# Altium project volt_sense.PrjPCB
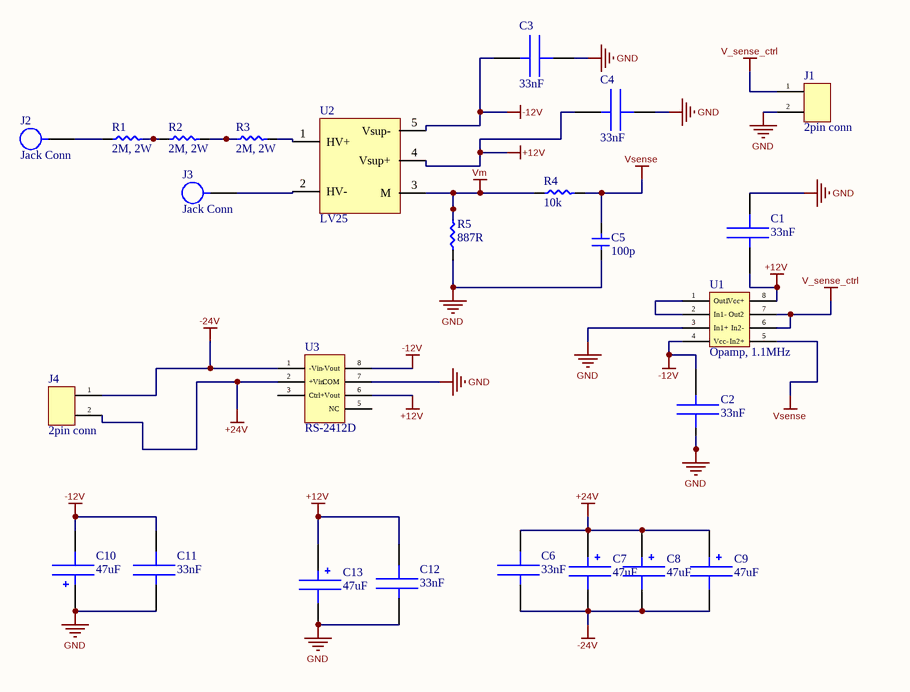
[diagram p0: volt_sense.SchDoc]
1 sheet, 25 parts. Net scope: global (net labels, ports and power ports of the same name join across sheets).
Board file: volt_sense.PcbDoc

## Sheet volt_sense.SchDoc
size A3

### Parts
C1  33nF  [C1206]
C2  33nF  [C1206]
C3  33nF  [C1206]
C4  33nF  [C1206]
C5  100p  [C0603]
C6  33nF  [C1206]
C7  47uF  [CAPAE7266X82N]
C8  47uF  [CAPAE7266X82N]
C9  47uF  [CAPAE7266X82N]
C10  47uF  [CAPAE7266X82N]
C11  33nF  [C1206]
C12  33nF  [C1206]
C13  47uF  [CAPAE7266X82N]
J1  2pin conn  [2pin_0.1in]
J2  Jack Conn  [575-4]
J3  Jack Conn  [575-4]
J4  2pin conn  [2pin_0.1in]
R1  2M, 2W  [R2512]
R2  2M, 2W  [R2512]
R3  2M, 2W  [R2512]
R4  10k  [R0603]
R5  887R  [R0603]
U1  Opamp, 1.1MHz  [SO8]
U2  LV25  [LV25-P]
U3  RS-2412D  [RS2412D]

### Nets
+12V: C1.1 C4.1 C12.2 C13.1 U1.8(Vcc+) U2.4(Vsup+) U3.6(+Vout)
+24V: C6.2 C7.1 C8.1 C9.1 J4.2 U3.2(+Vin)
-12V: C2.1 C3.1 C10.2 C11.2 U1.4(Vcc-) U2.5(Vsup-) U3.8(-Vout)
-24V: C6.1 C7.2 C8.2 C9.2 J4.1 U3.1(-Vin)
GND: C1.2 C2.2 C3.2 C4.2 C5.1 C10.1 C11.1 C12.1 C13.2 J1.2 R5.1 U1.3(In1+) U3.7(COM)
V_sense_ctrl: J1.1 U1.6(In2-) U1.7(Out2)
Vm: R4.1 R5.2 U2.3(M)
Vsense: C5.2 R4.2 U1.5(In2+)
NetJ2_1: J2.1 R1.1
NetJ3_1: J3.1 U2.2(HV-)
NetR1_2: R1.2 R2.1
NetR2_2: R2.2 R3.1
NetR3_2: R3.2 U2.1(HV+)
NetU1_1: U1.1(Out1) U1.2(In1-)

Not connected (* = marked no-connect by the designer): U3 3(Ctrl) 5(NC)

### Library data of the parts
C1-C4 C6 C11 C12 = CL31B333JBCNNNC: Cap Ceramic 0.033uF 50V X7R 5% SMD 1206 125C Paper T/R; Manufacturer: Samsung; Supplier 1: Digi-Key; Manufacturer Part Number: CL31B333JBCNNNC; Stock 1: 21; Pricing 1: 1=0.18, 10=0.131, 100=0.0614, 500=0.04308, 1000=0.03567 (USD); Mount: Surface Mount; Case/Package: 1206; Case Code (Metric): 3216; Case Code (Imperial): 1206; Min Operating Temperature: -55°C; Max Operating Temperature: 125°C; Tolerance: 5%; Packaging: Tape and Reel; Capacitance: 33nF; Voltage Rating: 50V; Package Quantity: 1; Dielectric: X7R; Voltage: 50V; Voltage Rating (DC): 50V; Length: 3.2mm; Height: 0.85mm; Width: 0.063inch; Thickness: 0.039inch; Depth: 1.6mm; Radiation Hardening: No; Lead Free: Lead Free; Supplier Part Number 1: 1276-1774-6-ND
C5 = 06035C101KAT2A: Cap Ceramic 100pF 50V X7R 10% SMD 0603 125C T/R; Manufacturer: Kyocera AVX; Dissipation Factor: 2.5%; Temperature Coefficient: 0ppm/°C; Supplier 1: Mouser; Manufacturer Part Number: 06035C101KAT2A; Stock 1: 28330; Pricing 1: 1=0.27, 10=0.181, 50=0.181, 100=0.091, 1000=0.055, 10000=0.038 (USD); Mount: Surface Mount; Case/Package: 0603; Number of Pins: 2; Case Code (Metric): 1608; Case Code (Imperial): 0603; Contact Plating: Tin,Matte; Dielectric Material: Ceramic; Min Operating Temperature: -55°C; Max Operating Temperature: 125°C; Package Quantity: 1; Capacitance: 100pF; Tolerance: 10%; Packaging: Tape and Reel; Voltage Rating: 50V; Voltage Rating (DC): 50V; Dielectric: X7R; Termination: SMD/SMT; Length: 1.6mm; Width: 0.032inch; Thickness: 0.035inch; Depth: 0.81mm; Radiation Hardening: No; REACH SVHC: No SVHC; Lead Free: Lead Free; ComponentLink1URL: http://www.mouser.com/ds/2/40/X7RDielectric-777024.pdf?src-supplier=Mouser; ComponentLink1Description: http://www.mouser.com/ds/2/40/X7RDielectric-777024.pdf?src-supplier=Mouser; ComponentLink2URL: http://www.farnell.com/datasheets/1679506.pdf?src-supplier=Element14; ComponentLink2Description: http://www.farnell.com/datasheets/1679506.pdf?src-supplier=Element14; ComponentLink3URL: http://www.jameco.com/Jameco/Products/ProdDS/2012486.pdf?src-supplier=Jameco; ComponentLink3Description: http://www.jameco.com/Jameco/Products/ProdDS/2012486.pdf?src-supplier=Jameco; ComponentLink4URL: http://www.avx.com/docs/Catalogs/cx7r.pdf?src-supplier=Future+Electronics; ComponentLink4Description: http://www.avx.com/docs/Catalogs/cx7r.pdf?src-supplier=Future+Electronics; ComponentLink5URL: http://catalogs.avx.com/SurfaceMount.pdf?src-supplier=Digi-Key; ComponentLink5Description: http://catalogs.avx.com/SurfaceMount.pdf?src-supplier=Digi-Key; Supplier Part Number 1: 581-06035C101K
C7-C10 C13 = UCD1H470MCL1GS: Aluminum Electrolytic Capacitors - SMD 47uF 50V 105c; Manufacturer: Nichicon; Tolerance: 20%; Impedance: 630mR; Life (Hours): 2000Hour; Ripple Current: 195mA; Leakage Current: 493.5uA; Dissipation Factor: 0.1%; Supplier 1: Digi-Key; Manufacturer Part Number: UCD1H470MCL1GS; Stock 1: 232; Pricing 1: 1=0.55, 10=0.39, 100=0.2566 (USD); Mount: Surface Mount; Case/Package: Radial; Min Operating Temperature: -55°C; Max Operating Temperature: 105°C; Capacitance: 47uF; Voltage Rating: 50V; Packaging: Tape and Reel; Package Quantity: 1; Voltage Rating (DC): 50V; Termination: SMD/SMT; Voltage: 50V; Diameter: 6.3mm; Length: 7.7mm; Height: 7.7mm; Height - Seated (Max): 0.315inch; Radiation Hardening: No; Lead Free: Lead Free; ComponentLink1URL: http://www.nichicon.co.jp/english/products/pdfs/e-cd.pdf; ComponentLink1Description: http://www.nichicon.co.jp/english/products/pdfs/e-cd.pdf; ComponentLink2URL: http://nichicon-us.com/english/products/pdfs/e-ucd.pdf; ComponentLink2Description: http://nichicon-us.com/english/products/pdfs/e-ucd.pdf; ComponentLink3URL: http://uk.rs-online.com/webdocs/0ebd/0900766b80ebdadd.pdf; ComponentLink3Description: http://uk.rs-online.com/webdocs/0ebd/0900766b80ebdadd.pdf; ComponentLink4URL: http://products.nichicon.co.jp/en/pdf/XJA043/e-cd.pdf; ComponentLink4Description: http://products.nichicon.co.jp/en/pdf/XJA043/e-cd.pdf; Supplier Part Number 1: 493-6183-6-ND
J1 J4 = 640456-2: CONN HEADER VERT 2POS 2.54MM; Manufacturer: TE Connectivity; Connector Type: Connector,Pin,Plug,Header; Contact Resistance: 6mR; Max Voltage Rating (AC): 250V; Number of Positions: 2; Backwall/Post Interruptions: No (Without); Connector System: Wire-to-Board; Plating Thickness: 3.81um; PCB Mount Retention: Without; Contact Current Rating: 5A; Gender: Male; PCB Mounting Orientation: Vertical; Circuit Application: Signal; Contact Style: Straight; Mating Connector Lock: Yes (With); Contact Post Length: 3.56mm; PCB Thickness: 0.063inch; Tail Length: 0.14inch; Approvals: CSA; Supplier 1: Digi-Key; Manufacturer Part Number: 640456-2; Stock 1: 105696; Pricing 1: 1=0.11, 10=0.107, 100=0.0663, 500=0.05486, 1000=0.048, 5000=0.04114, 10000=0.04 (USD); Mount: Through Hole; Color: Natural,White,Beige; Contact Plating: Tin; Contact Material: Copper Alloy; Housing Color: Natural; Housing Material: Polyester; Contact Shape: Square; Min Operating Temperature: -67°C; Max Operating Temperature: 221°C; Package Quantity: 5000; Packaging: Bulk; Termination: Solder; Number of Rows: 1; Fastening Type: Friction; Contact Gender: Male; Voltage Rating (AC): 250V; Number of Contacts: 2; Orientation: Straight; Contact Retention: No (Without); Mating Alignment: No (Without); Mating Retention: No (Without); PCB Mount Alignment: No (Without); Sealable: No (Without); Strain Relief: No (Without); Shrouded: No (Without); Current Rating: 5A; Number of Poles: 2; Voltage Rating: 250V; Working Voltage: 250V; Panel Mount Retention: No (Without); Mounting Ears: No (Without); Length: 7.62mm; Height: 7.87mm; Pitch: 2.54mm; Depth: 5.72mm; Lead Pitch: 2.54mm; Contact Mating Length: 7.49mm; Radiation Hardening: No; ELV: Compliant; Lead Free: Lead Free; Flammability Rating: UL94 V-0; REACH SVHC: No SVHC; ComponentLink1URL: https://www.te.com/commerce/DocumentDelivery/DDEController?Action=srchrtrv&DocNm=640456&DocType=Customer+Drawing&DocLang=English&src-supplier=Digi-Key; ComponentLink1Description: https://www.te.com/commerce/DocumentDelivery/DDEController?Action=srchrtrv&DocNm=640456&DocType=Customer+Drawing&DocLang=English&src-supplier=Digi-Key; ComponentLink2URL: http://www.te.com/commerce/DocumentDelivery/DDEController?Action=showdoc&DocId=Data+Sheet%7F82056_MTA%7F0608%7Fpdf%7FEnglish%7FENG_DS_82056_MTA_0608.pdf%7F640456-6&src-supplier=Avnet; ComponentLink2Description: http://www.te.com/commerce/DocumentDelivery/DDEController?Action=showdoc&DocId=Data+Sheet%7F82056_MTA%7F0608%7Fpdf%7FEnglish%7FENG_DS_82056_MTA_0608.pdf%7F640456-6&src-supplier=Avnet; ComponentLink3URL: https://www.distrelec.biz/Web/Downloads/43/01/04384301.pdf?mime=application%2Fpdf&src-supplier=Distrelec; ComponentLink3Description: https://www.distrelec.biz/Web/Downloads/43/01/04384301.pdf?mime=application%2Fpdf&src-supplier=Distrelec; ComponentLink4URL: http://www.farnell.com/datasheets/2043229.pdf?src-supplier=Newark; ComponentLink4Description: http://www.farnell.com/datasheets/2043229.pdf?src-supplier=Newark; ComponentLink5URL: http://www.te.com/commerce/DocumentDelivery/DDEController?Action=showdoc&DocId=Data+Sheet%7F82056_MTA%7F0608%7Fpdf%7FEnglish%7FENG_DS_82056_MTA_0608.pdf%7F640456-2&src-supplier=Future+Electronics; ComponentLink5Description: http://www.te.com/commerce/DocumentDelivery/DDEController?Action=showdoc&DocId=Data+Sheet%7F82056_MTA%7F0608%7Fpdf%7FEnglish%7FENG_DS_82056_MTA_0608.pdf%7F640456-2&src-supplier=Future+Electronics; ComponentLink6URL: http://www.te.com/commerce/DocumentDelivery/DDEController?Action=showdoc&DocId=Data+Sheet%7F82056_MTA%7F0608%7Fpdf%7FEnglish%7FENG_DS_82056_MTA_0608.pdf%7F640456-6&src-supplier=Avnet+Asia; ComponentLink6Description: http://www.te.com/commerce/DocumentDelivery/DDEController?Action=showdoc&DocId=Data+Sheet%7F82056_MTA%7F0608%7Fpdf%7FEnglish%7FENG_DS_82056_MTA_0608.pdf%7F640456-6&src-supplier=Avnet+Asia; Supplier Part Number 1: A1921-ND
J2 J3 = 575-4: JACK NON-INSULATED .218"; Manufacturer: Keystone Electronics; Gender: Female; Number of Positions: 1; Supplier 1: Digi-Key; Manufacturer Part Number: 575-4; Stock 1: 21251; Pricing 1: 1=0.84, 10=0.692, 50=0.6244, 250=0.543, 1000=0.4558, 2500=0.4073, 5000=0.3801 (USD); Mount: Panel,Through Hole; Number of Pins: 1; Contact Plating: Nickel; Color: White; Contact Material: Brass; Material: Brass,Tin; Packaging: Bulk; Package Quantity: 100; Termination: Solder; Insulation: Non-Insulated; Lead Free: Lead Free; ComponentLink1URL: http://www.mouser.com/ds/2/215/75-4_575-8-743912.pdf?src-supplier=Mouser; ComponentLink1Description: http://www.mouser.com/ds/2/215/75-4_575-8-743912.pdf?src-supplier=Mouser; ComponentLink2URL: http://www.keyelco.com/pdfs/M60/M60p107.pdf?src-supplier=Digi-Key; ComponentLink2Description: http://www.keyelco.com/pdfs/M60/M60p107.pdf?src-supplier=Digi-Key; Supplier Part Number 1: 36-575-4-ND
R1-R3 = SMV2W1M2JT: Manufacturer: TE Connectivity; Supplier 1: Mouser; Manufacturer Part Number: SMV2W1M2JT; Stock 1: 1000; Pricing 1: 1=0.71, 10=0.481, 50=0.481, 100=0.354, 1000=0.204, 10000=0.193 (USD); Supplier Part Number 1: 279-SMV2W1M2JT
R4 = RNCP0603FTD10K0: RES 10K OHM 1% 1/8W 0603; Manufacturer: Stackpole Electronics; Resistance: 10kR; Max Power Dissipation: 125mW; Temperature Coefficient: 100ppm/°C; Supplier 1: Digi-Key; Manufacturer Part Number: RNCP0603FTD10K0; Stock 1: 166858; Pricing 1: 1=0.1, 10=0.067, 100=0.0273, 1000=0.01224, 2500=0.01063 (USD); Mount: Surface Mount; Case/Package: 0603; Case Code (Metric): 1608; Case Code (Imperial): 0603; Contact Plating: Tin,Matte; Min Operating Temperature: -55°C; Max Operating Temperature: 155°C; Packaging: Tape and Reel; Tolerance: 1%; Composition: Thin Film; Number of Terminations: 2; Features: Moisture Resistant,Anti-Sulfur; Length: 0.059inch; Height: 0.02inch; Width: 0.031inch; Radiation Hardening: No; Lead Free: Lead Free; Supplier Part Number 1: RNCP0603FTD10K0CT-ND
R5 = ERA-3AEB8870V: RES SMD 887 OHM 0.1% 1/10W 0603; Manufacturer: Panasonic; Max Power Dissipation: 100mW; Temperature Coefficient: 25ppm/°C; Supplier 1: Digi-Key; Manufacturer Part Number: ERA-3AEB8870V; Stock 1: 18104; Pricing 1: 1=0.35, 10=0.3, 100=0.1172, 1000=0.04906, 2500=0.04498 (USD); Case/Package: 0603; Case Code (Imperial): 0603; Case Code (Metric): 1608; Min Operating Temperature: -55°C; Max Operating Temperature: 155°C; Composition: Thin Film; Features: Automotive AEC-Q200; Packaging: Tape and Reel; Resistance: 887R; Tolerance: 0.1%; Number of Terminations: 2; Length: 0.063inch; Width: 0.032inch; Height - Seated (Max): 0.022inch; Supplier Part Number 1: P887DBDKR-ND
U1 = LM358DT: IC OPAMP GP 1.1MHZ 8SO; Manufacturer: STMicroelectronics; Slew Rate: 0.6V/µs; Number of Channels: 2; Nominal Supply Current: 1.2mA; Common Mode Rejection Ratio: 70dB; Max Supply Voltage: 30V; Min Supply Voltage: 3V; Min Dual Supply Voltage: 1.5V; Max Dual Supply Voltage: 15V; Max Output Current: 60mA; Voltage Gain: 100dB; Dual Supply Voltage: 9V; Output Current: 40mA; Max Input Voltage: 28.5V; Min Input Voltage: 0uV; Input Bias Current: 150nA; Input Offset Voltage (Vos): 7mV; Operating Supply Current: 700uA; Supplier 1: Digi-Key; Manufacturer Part Number: LM358DT; Stock 1: 82250; Pricing 1: 1=0.48, 10=0.359, 100=0.2239, 500=0.1532, 1000=0.11784 (USD); Mount: Surface Mount; Case/Package: SOIC; Number of Pins: 8; Weight: 0.01lb; Contact Plating: Tin,Matte; Min Operating Temperature: 0°C; Max Operating Temperature: 70°C; Packaging: Tape and Reel; Bandwidth: 1.1MHz; Number of Circuits: 2; Gain Bandwidth Product: 1.1MHz; Unity Gain Bandwidth Product: 1.1MHz; Package Quantity: 2500; Operating Supply Voltage: 15V; Output Current per Channel: 60mA; Number of Elements: 2; Number of Amplifiers: 2; Length: 4.9mm; Height: 1.25mm; Width: 3.9mm; Radiation Hardening: No; REACH SVHC: No SVHC; Lead Free: Lead Free; ComponentLink1URL: http://www.st.com/content/ccc/resource/technical/document/datasheet/61/46/87/01/98/ed/44/c5/CD00000464.pdf/files/CD00000464.pdf/jcr:content/translations/en.CD00000464.pdf?src-supplier=Digi-Key; ComponentLink1Description: http://www.st.com/content/ccc/resource/technical/document/datasheet/61/46/87/01/98/ed/44/c5/CD00000464.pdf/files/CD00000464.pdf/jcr:content/translations/en.CD00000464.pdf?src-supplier=Digi-Key; ComponentLink2URL: http://www.st.com/web/en/resource/technical/document/datasheet/CD00000464.pdf?src-supplier=Future+Electronics; ComponentLink2Description: http://www.st.com/web/en/resource/technical/document/datasheet/CD00000464.pdf?src-supplier=Future+Electronics; ComponentLink3URL: http://www.alliedelec.com/images/products/datasheets/bm/STMICROELECTRONICS/70013561.pdf?src-supplier=Allied+Electronics; ComponentLink3Description: http://www.alliedelec.com/images/products/datasheets/bm/STMICROELECTRONICS/70013561.pdf?src-supplier=Allied+Electronics; ComponentLink4URL: https://www.verical.com/server-webapp/html/getDatasheet?partID=39583&src-supplier=Verical; ComponentLink4Description: https://www.verical.com/server-webapp/html/getDatasheet?partID=39583&src-supplier=Verical; ComponentLink5URL: http://datasheet.iiic.cc/stmicroelectronics/LM358DT.pdf?src-supplier=IIIC; ComponentLink5Description: http://datasheet.iiic.cc/stmicroelectronics/LM358DT.pdf?src-supplier=IIIC; ComponentLink6URL: http://www.produktinfo.conrad.com/datenblaetter/150000-174999/155599-da-01-en-OP_VERST_LM358DT_STM.pdf?src-supplier=Conrad; ComponentLink6Description: http://www.produktinfo.conrad.com/datenblaetter/150000-174999/155599-da-01-en-OP_VERST_LM358DT_STM.pdf?src-supplier=Conrad; Supplier Part Number 1: 497-1591-6-ND
U2 = LV25-P: Manufacturer: LEM; Secondary Current: 25mA; Min Supply Voltage: -15V; Max Supply Voltage: 15V; Response Time: 40us; Input Current: 10mA; Accuracy: 0.9%; Output Type: Voltage; Supplier 1: Digi-Key; Manufacturer Part Number: LV25-P; Stock 1: 51; Pricing 1: 1=68, 5=64.6, 10=59.5, 25=52.7, 50=51, 100=49.3 (USD); Mount: PCB; Min Operating Temperature: 0°C; Max Operating Temperature: 70°C; Max Output Current: 25mA; Current Rating: 10mA; Height: 15.1mm; Width: 26mm; Lead Free: Contains Lead; REACH SVHC: No SVHC; ComponentLink1URL: https://www.lem.com/sites/default/files/products_datasheets/lv_25-p.pdf?src-supplier=Digi-Key; ComponentLink1Description: https://www.lem.com/sites/default/files/products_datasheets/lv_25-p.pdf?src-supplier=Digi-Key; ComponentLink2URL: https://www.distrelec.biz/Web/Downloads/_t/ds/LV25P_eng_tds.pdf?mime=application%2Fpdf&src-supplier=Distrelec; ComponentLink2Description: https://www.distrelec.biz/Web/Downloads/_t/ds/LV25P_eng_tds.pdf?mime=application%2Fpdf&src-supplier=Distrelec; ComponentLink3URL: http://www.farnell.com/datasheets/51633.pdf?src-supplier=Newark; ComponentLink3Description: http://www.farnell.com/datasheets/51633.pdf?src-supplier=Newark; ComponentLink4URL: http://www.farnell.com/datasheets/1866272.pdf?src-supplier=Element14; ComponentLink4Description: http://www.farnell.com/datasheets/1866272.pdf?src-supplier=Element14; ComponentLink5URL: http://datasheet.iiic.cc/lem/LV25-P.pdf?src-supplier=IIIC; ComponentLink5Description: http://datasheet.iiic.cc/lem/LV25-P.pdf?src-supplier=IIIC; Supplier Part Number 1: 398-1019-ND
U3 = RS-2412D: CONV DC/DC 2W DL +/-12V OUT SIP8; Manufacturer: Recom; Min Input Voltage: 18V; Max Input Voltage: 36V; Number of Outputs: 2; Nominal Output Voltage: -12V; Max Output Current: 83mA; Output Voltage: 12V; Efficiency: 83%; Nominal Input Voltage: 24V; Isolation Voltage: 1kV; Current - Output 2: -83mA; Isolation: Isolated; Supplier 1: Digi-Key; Manufacturer Part Number: RS-2412D; Stock 1: 391; Pricing 1: 1=15.96, 5=15.834, 22=15.71364, 44=15.47205, 66=14.98848, 110=13.538, 264=13.29625, 506=13.05451 (USD); Mount: Through Hole,PCB; Case/Package: SIP; Number of Pins: 7; Weight: 4.7g; Min Operating Temperature: -40°C; Max Operating Temperature: 85°C; Output Current: 83mA; Power Rating: 2W; Packaging: Rail/Tube; Package Quantity: 22; Output Power: 2W; Min Input Voltage (DC): 18V; Max Input Voltage (DC): 36V; Voltage - Output 1: 12V; Voltage - Output 2: -12V; Current - Output 1: 83mA; Max Output Power: 2W; Max Power Dissipation: 2W; Max Output Voltage: 12V; Features: SCP; Length: 21.8mm; Height: 11.1mm; Width: 9.2mm; Depth: 21.8mm; REACH SVHC: No SVHC; Lead Free: Lead Free; ComponentLink1URL: http://uk.rs-online.com/webdocs/135e/0900766b8135ed55.pdf?src-supplier=RSComponents; ComponentLink1Description: http://uk.rs-online.com/webdocs/135e/0900766b8135ed55.pdf?src-supplier=RSComponents; ComponentLink2URL: https://www.recom-power.com/pdf/Econoline/RS-S_D_Z.pdf?src-supplier=Digi-Key; ComponentLink2Description: https://www.recom-power.com/pdf/Econoline/RS-S_D_Z.pdf?src-supplier=Digi-Key; ComponentLink3URL: https://www.distrelec.biz/Web/Downloads/ry/rs/ryRS.pdf?mime=application%2Fpdf&src-supplier=Distrelec; ComponentLink3Description: https://www.distrelec.biz/Web/Downloads/ry/rs/ryRS.pdf?mime=application%2Fpdf&src-supplier=Distrelec; ComponentLink4URL: http://www.recom-international.com/pdf/Econoline/RS-S_D_Z.pdf?src-supplier=Future+Electronics; ComponentLink4Description: http://www.recom-international.com/pdf/Econoline/RS-S_D_Z.pdf?src-supplier=Future+Electronics; ComponentLink5URL: http://www.produktinfo.conrad.com/datenblaetter/150000-174999/154843-da-01-en-DC_DC_WANDLER.pdf?src-supplier=Conrad; ComponentLink5Description: http://www.produktinfo.conrad.com/datenblaetter/150000-174999/154843-da-01-en-DC_DC_WANDLER.pdf?src-supplier=Conrad; Supplier Part Number 1: 945-1315-ND